# Altium schematic sheet USB & Battery Charging.SchDoc
size A4; Date: 08-May-2020; ApprovedBy: Vijay; CheckedBy: Vijay; CompanyName: Embdes Engineering Solutions Pvt. Ltd.; DrawnBy: Sandeep G; Organization: Altium Limited; Address1: e2-s.com; DocumentNumber: ECG_BLE.PCBA; Revision: Rev1.0; SheetNumber: 4; SheetTotal: 4; ApprovedByDate: <DATE>; CheckedByDate: <DATE>; DrawnByDate: <DATE>; PageName: USB & Battery Charging; PageSetup: Record=PageOptions|CenterHorizontal=True|CenterVertical=True|PrintScale=0.71|XCorrection=1.00|YCorrection=1.00|PrintKind=1|BorderSize=5000000|LeftOffset=0|BottomOffset=0|Orientation=2|PaperLength=1000|PaperWidth=1000|Scale=100|PaperSource=15|PrintQuality=-4|MediaType=1|DitherType=10|PaperKind=Ledger.|PrintScaleMode=1; ProjectName: <Project Name>
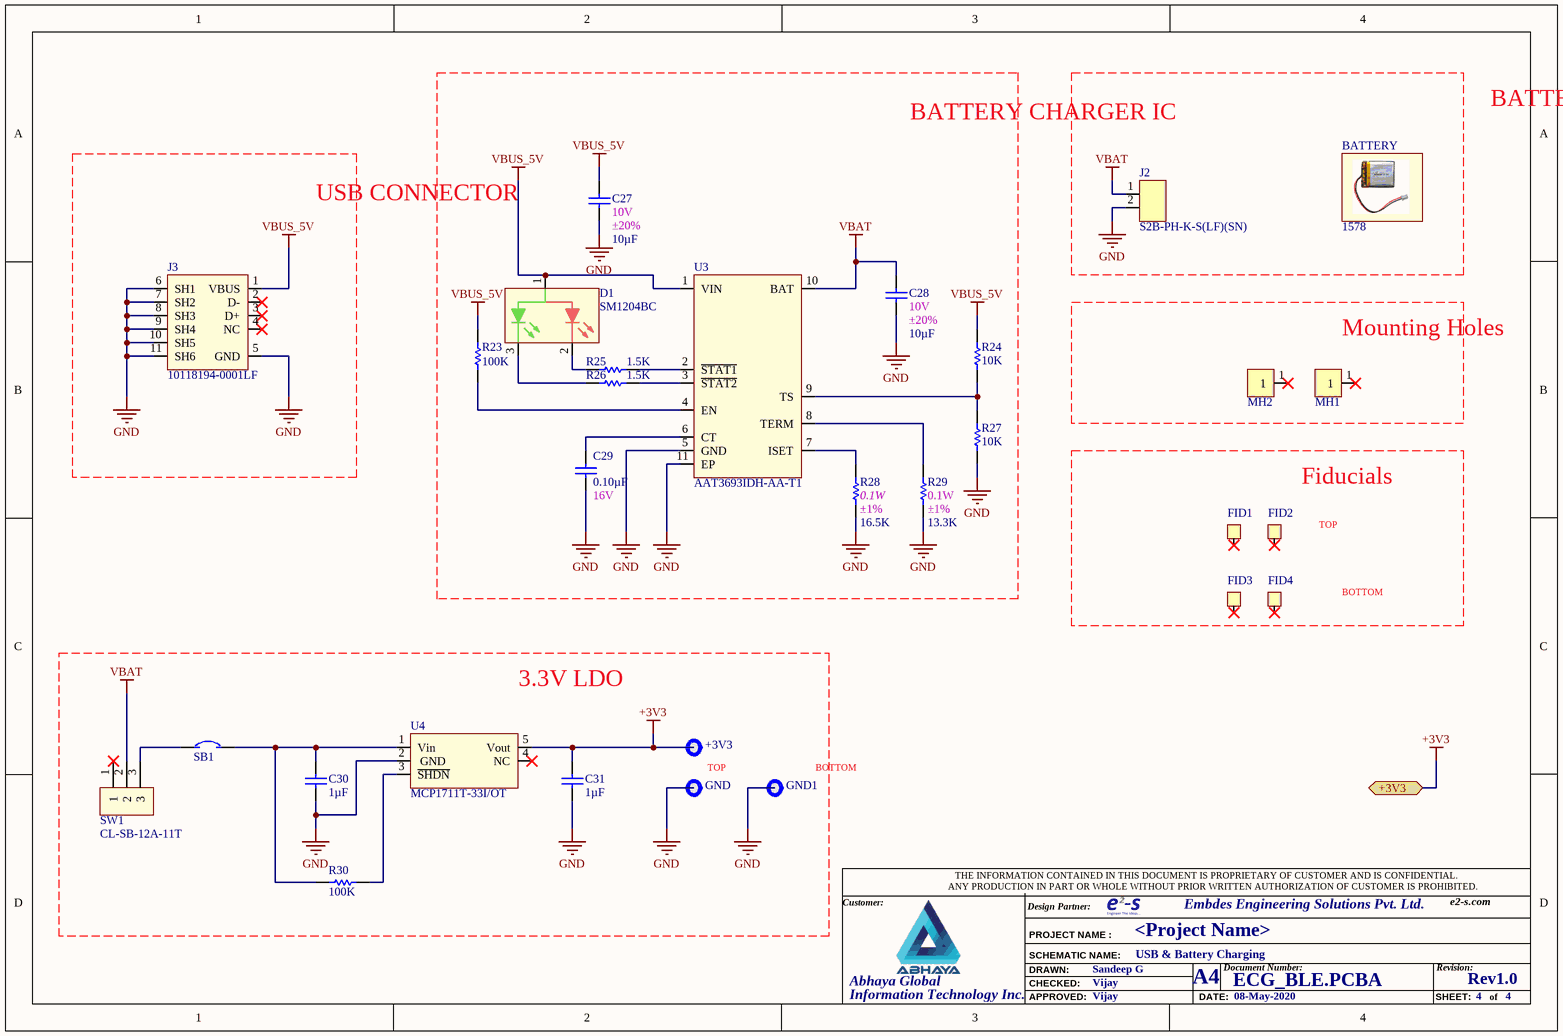
[diagram p0: USB & Battery Charging.SchDoc]

## Parts
+3V3  TEST POINT  [TP_40X40]  (value not drawn)
BATTERY  value 1578  (hidden comment: BATTERY LITHIUM 3.7V 500MAH)  (graphical)
C27  value 10µF  1st Auxiliary Field: 10V  2nd Auxiliary Field: ±20%  [SMDC0402]  (hidden comment: CAP CER 10UF 10V X5R 0402)
C28  value 10µF  1st Auxiliary Field: 10V  2nd Auxiliary Field: ±20%  [SMDC0402]  (hidden comment: CAP CER 10UF 10V X5R 0402)
C29  value 0.10µF  1st Auxiliary Field: 16V  [SMDC0402]  (hidden comment: CAP CER 0.1UF 16V X7R 0402)
C30  value 1µF  [SMDC0402]  (hidden comment: CAP CER 1UF 16V X5R 0402)
C31  value 1µF  [SMDC0402]  (hidden comment: CAP CER 1UF 16V X5R 0402)
D1  value SM1204BC  [LED-SM1204BC]  (hidden comment: LED GREEN/RED CLEAR 1204 SMD R/A)
FID1  FID40X40  [FID40X40]  (value not drawn)
FID2  FID40X40  [FID40X40]  (value not drawn)
FID3  FID40X40  [FID40X40]  (value not drawn)
FID4  FID40X40  [FID40X40]  (value not drawn)
GND  TEST POINT  [TP_40X40]  (value not drawn)
GND1  TEST POINT  [TP_40X40]  (value not drawn)
J2  value S2B-PH-K-S(LF)(SN)  [SHDRRA2W70P0_200_1X2_590X790X550P]  (hidden comment: CONN HOUSING PH 2POS 2MM WHITE)
J3  value 10118194-0001LF  [USB_MICRO_B_10118194-0001LF]  (hidden comment: CONN USB MICRO B RECPT SMT R/A)
MH1  Mounting hole  [MH_2P2MM_3P6KP]  (value not drawn)
MH2  Mounting hole  [MH_2P2MM_3P6KP]  (value not drawn)
R23  value 100K  [SMDRC0402]  (hidden comment: RES SMD 100K OHM 1% 1/10W 0402)
R24  value 10K  [SMDR0402]  (hidden comment: RES SMD 10K OHM 1% 1/10W 0402)
R25  value 1.5K  [SMDR0402]  (hidden comment: RES SMD 1.5K OHM 1% 1/10W 0402)
R26  value 1.5K  [SMDR0402]  (hidden comment: RES SMD 1.5K OHM 1% 1/10W 0402)
R27  value 10K  [SMDR0402]  (hidden comment: RES SMD 10K OHM 1% 1/10W 0402)
R28  value 16.5K  1st Auxiliary Field: 0.1W  2nd Auxiliary Field: ±1%  [SMDR0402]  (hidden comment: RES SMD 16.5K OHM 1% 1/10W 0402)
R29  value 13.3K  1st Auxiliary Field: 0.1W  2nd Auxiliary Field: ±1%  [SMDR0402]  (hidden comment: RES SMD 13.3K OHM 1% 1/10W 0402)
R30  value 100K  [SMDRC0402]  (hidden comment: RES SMD 100K OHM 1% 1/10W 0402)
SB1  EMS_SB0805  [SB_0805]  (value not drawn)  (net tie, no BOM)
SW1  value CL-SB-12A-11T  [SWITCH_CLSB12A11T]  (hidden comment: SWITCH SLIDE SPDT 200MA 12V)
U3  value AAT3693IDH-AA-T1  [SON40P220X220x80_HS-11N]  (hidden comment: 1.6A LINEAR LI-ION CHGR 10TDFN)
U4  Manufacturer Part Number: MCP1711T-33I/OT  [SOT95P350X145-5N]  (hidden comment: IC REG LINEAR 3.3V 150MA SOT23-5)

## Ports
+3V3

## Nets
+3V3: +3V3.1 C31.2 U4.5(Vout) ; port +3V3
GND: C27.2 C28.2 C29.1 C30.1 C31.1 GND.1 GND1.1 J2.2 J3.5(GND) J3.6(SH1) J3.7(SH2) J3.8(SH3) J3.9(SH4) J3.10(SH5) J3.11(SH6) R27.2 R28.1 R29.2 U3.5(GND) U3.11(EP) U4.2(GND)
VBAT: C28.1 J2.1 SW1.2 U3.10(BAT)
VBUS_5V: C27.1 D1.1(A) J3.1(VBUS) R23.1 R24.1 U3.1(VIN)
NetC29_2: C29.2 U3.6(CT)
NetC30_2: C30.2 R30.2 SB1.2 U4.1(Vin)
NetD1_2: D1.2(K) R25.2
NetD1_3: D1.3(K) R26.2
NetR23_2: R23.2 U3.4(EN)
NetR24_2: R24.2 R27.1 U3.9(TS)
NetR25_1: R25.1 U3.2(~{STAT1})
NetR26_1: R26.1 U3.3(~{STAT2})
NetR28_2: R28.2 U3.7(ISET)
NetR29_1: R29.1 U3.8(TERM)
NetR30_1: R30.1 U4.3(~{SHDN})
NetSB1_1: SB1.1 SW1.3

Not connected (* = marked no-connect by the designer): FID1 0*; FID2 0*; FID3 0*; FID4 0*; J3 2(D-)* 3(D+)* 4(NC)*; MH1 1*; MH2 1*; SW1 1*; U4 4(NC)*

## Notes on the sheet
- (near BATTERY) BATTERY & BATTERY CONNECTOR
- BATTERY CHARGER IC
- USB CONNECTOR
- Mounting Holes
- Fiducials
- (near FID2) TOP
- (near FID4) BOTTOM
- 3.3V LDO
- TOP
- (near GND1) BOTTOM
- Customer:
- Design Partner:
- THE INFORMATION CONTAINED IN THIS DOCUMENT IS PROPRIETARY OF CUSTOMER AND IS CONFIDENTIAL.
- ANY PRODUCTION IN PART OR WHOLE WITHOUT PRIOR WRITTEN AUTHORIZATION OF CUSTOMER IS PROHIBITED.
- Abhaya Global
- DRAWN:
- CHECKED:
- PROJECT NAME :
- SCHEMATIC NAME:
- A4
- Document Number:
- Revision:
- Information Technology Inc.
- APPROVED:
- DATE:
- SHEET:
- of

## Library data of the parts
+3V3 GND GND1 = EMS-TP40X40-S: 1st Auxiliary Field: Black; Component Height (mm): *; Manufacturer: *; Part Type: TEST POINT; Manufacturer Part Number: *; Internal Part Number: EMS-TP40X40-S
BATTERY = EMS-1578: Manufacturer: Adafruit Industries LLC; Vendor Part Number: 1528-1841-ND; 4th Auxiliary Field: 503035; Component Height (mm): 4.8mm; Vendor Name: Digi-Key; 2nd Auxiliary Field: 500mAh; 3rd Auxiliary Field: *; Internal Part Number: EMS-1578; Part Type: BATTERY LITHIUM 3.7V 500MAH; Temp Co: *; Manufacturer Part Number: 1578; 1st Auxiliary Field: 3.7V
C27 C28 = ECA10U0M10V0-SB: Manufacturer: Samsung Electro-Mechanics America, Inc.; Manufacturer Part Number: CL05A106MP5NUNC; Vendor Part Number: 1276-1450-1-ND; Component Height (mm): 0.70mm; Vendor Name: DigiKey; Part Type: CAP CER 10UF 10V X5R 0402; 3rd Auxiliary Field: *; Internal Part Number: ECA10U0M10V0-SB; Temp Co: X5R; 4th Auxiliary Field: *
C29 = ECA0U10K16V0-1-SB: Manufacturer: Samsung Electro-Mechanics America, Inc.; Manufacturer Part Number: CL05B104KO5NNNC; Vendor Part Number: 1276-1001-1-ND; Vendor Name: Digi-Key; 2nd Auxiliary Field: ±10%; Temp Co: X7R; Internal Part Number: ECA0U10K16V0-1-SB; 3rd Auxiliary Field: *; Component Height (mm): *; Part Type: CAP CER 0.1UF 16V X7R 0402; 4th Auxiliary Field: *
C30 C31 = ECA1U00L16V0-SB: Manufacturer: Samsung Electro-Mechanics; Vendor Part Number: 1276-1067-1-ND; Manufacturer Part Number: CL05A105KO5NNNC; Vendor Name: Digi-Key; 3rd Auxiliary Field: RoHS Compliant; Component Height (mm): 0.55MM; 2nd Auxiliary Field: ±10%; Part Type: CAP CER 1UF 16V X5R 0402; Internal Part Number: ECA1U00L16V0-SB; 4th Auxiliary Field: *; Temp Co: X5R; 1st Auxiliary Field: 16V
D1 = ELDGR2V0020M0-S: Manufacturer: Bivar Inc.; Vendor Part Number: 492-1228-1-ND; Vendor Name: Digi-Key; 2nd Auxiliary Field: 20mA Green, 20mA Red; 3rd Auxiliary Field: RoHS Compliant; Component Height (mm): 1.00mm; 1st Auxiliary Field: 2V Green, 2V Red; Part Type: LED GREEN/RED CLEAR 1204 SMD R/A; Manufacturer Part Number: SM1204BC; Internal Part Number: ELDGR2V0020M0-S; 4th Auxiliary Field: *; Temp Co: *
FID1-FID4 = FID_40X40
J2 = ECNJSTHE02-T: Vendor Part Number: 455-1719-ND; Manufacturer: JST Sales America Inc.; Vendor Name: Digi-Key; Component Height (mm): 4.8mm; Part Type: CONN HOUSING PH 2POS 2MM WHITE; 1st Auxiliary Field: 2 Pos; 2nd Auxiliary Field: 2mm; 3rd Auxiliary Field: *; Manufacturer Part Number: S2B-PH-K-S(LF)(SN); Internal Part Number: ECNJSTHE02-T; 4th Auxiliary Field: *; Temp Co: *
J3 = EINUSBBR06-S-1364: Manufacturer: Amphenol FCI; Vendor Part Number: 609-4618-1-ND; Component Height (mm): 3mm; 3rd Auxiliary Field: RoHS Compliant; Vendor Name: Digi-Key; Temp Co: -30°C ~ 80°C; 1st Auxiliary Field: USB - micro B; 2nd Auxiliary Field: 5 POS; Manufacturer Part Number: 10118194-0001LF; Part Type: CONN USB MICRO B RECPT SMT R/A; 4th Auxiliary Field: *; Internal Part Number: EINUSBBR06-S-1364
MH1 MH2 = EMS-MH2.2MM: Internal Part Number: EMS-MH2.2MM; Manufacturer: *; Manufacturer Part Number: *
R23 R30 = ERE100KG110-SB: Manufacturer Part Number: ERJ-2RKF1003X; Manufacturer: Panasonic Electronic Components; Vendor Part Number: P100KLCT-ND; Component Height (mm): 0.40mm; Vendor Name: Digi-Key; Temp Co: ±100ppm/°C; 1st Auxiliary Field: 0.1W; Part Type: RES SMD 100K OHM 1% 1/10W 0402; 3rd Auxiliary Field: *; 4th Auxiliary Field: *; Internal Part Number: ERE100KG110-SB; 2nd Auxiliary Field: ±1%
R24 R27 = ERE10K0G110-SB: Manufacturer: Panasonic Electronic Components; Manufacturer Part Number: ERJ-2RKF1002X; Vendor Part Number: P10.0KLCT-ND; Component Height (mm): 0.40mm; Vendor Name: Digi-Key; Temp Co: ±100ppm/°C; 1st Auxiliary Field: 0.1W; Part Type: RES SMD 10K OHM 1% 1/10W 0402; Internal Part Number: ERE10K0G110-SB; 2nd Auxiliary Field: ±1%
R25 R26 = ERE1K50G110-SB: Manufacturer: Panasonic Electronic Components; Manufacturer Part Number: ERJ-2RKF1501X; Vendor Part Number: P1.50KLCT-ND; Component Height (mm): 0.40mm; Vendor Name: Digi-Key; Temp Co: ±100ppm/°C; 1st Auxiliary Field: 0.1W; Part Type: RES SMD 1.5K OHM 1% 1/10W 0402; Internal Part Number: ERE1K50G110-SB; 2nd Auxiliary Field: ±1%
R28 = ERE16K5G110-SB: Manufacturer Part Number: ERJ-2RKF1652X; Manufacturer: Panasonic Electronic Components; Vendor Part Number: P16.5KLCT-ND; Component Height (mm): 0.40mm; Vendor Name: Digi-Key; Temp Co: ±100ppm/°C; Part Type: RES SMD 16.5K OHM 1% 1/10W 0402; 3rd Auxiliary Field: *; 4th Auxiliary Field: *; Internal Part Number: ERE16K5G110-SB
R29 = ERE13K3G110-SB: Manufacturer: Panasonic Electronic Components; Vendor Part Number: P13.3KLCT-ND; Manufacturer Part Number: ERJ-2RKF1332X; Component Height (mm): 0.40mm; Vendor Name: Digi-Key; Temp Co: ±100ppm/°C; Part Type: RES SMD 13.3K OHM 1% 1/10W 0402; 3rd Auxiliary Field: *; 4th Auxiliary Field: *; Internal Part Number: ERE13K3G110-SB
SB1 = EMS_SB0805: *; Manufacturer: *; Part Type: *; Vendor Name: *; Vendor Part Number: *; 3rd Auxiliary Field: *; Manufacturer Part Number: *; Internal Part Number: EMS_SB0805; 4th Auxiliary Field: *; Component Height (mm): *; Temp Co: *; 2nd Auxiliary Field: *; 1st Auxiliary Field: *; Value: *
SW1 = EMS-CL-SB-12A-11T: Manufacturer: Nidec Copal Electronics; Vendor Part Number: 563-1316-1-ND; 3rd Auxiliary Field: ROHS3 Compliant; Component Height (mm): 3.5mm; Temp Co: -40°C ~ 85°C; Vendor Name: Digi-Key; 1st Auxiliary Field: 200mA (DC); 2nd Auxiliary Field: SPDT; 4th Auxiliary Field: *; Internal Part Number: EMS-CL-SB-12A-11T; Part Type: SWITCH SLIDE SPDT 200MA 12V; Manufacturer Part Number: CL-SB-12A-11T
U3 = EICSSTDFN-10-1864: Manufacturer: Skyworks Solutions Inc.; Vendor Part Number: 863-1512-1-ND; 3rd Auxiliary Field: ROHS3 Compliant; Component Height (mm): 0.8mm; Temp Co: -40°C ~ 85°C (TA); Vendor Name: Digi-Key; 1st Auxiliary Field: 7.5V; 2nd Auxiliary Field: 1.6A; 4th Auxiliary Field: *; Internal Part Number: EICSSTDFN-10-1864; Part Type: 1.6A LINEAR LI-ION CHGR 10TDFN; Manufacturer Part Number: AAT3693IDH-AA-T1
U4 = EICMTSOT23-5-****: Manufacturer: Microchip Technology; Vendor Part Number: MCP1711T-33I/OTCT-ND; 1st Auxiliary Field: 6V; 3rd Auxiliary Field: RoHS Compliant; Component Height (mm): 1.45mm; Temp Coefficient: -40°C ~ 85°C; Value: MCP1711T-33I/OT; Vendor: Digi-Key; 2nd Auxiliary Field: 150mA; 4th Auxiliary Field: 3.3V; Internal Part Number: EICMTSOT23-5-****; Part Type: IC REG LINEAR 3.3V 150MA SOT23-5